# EasyEDA Pro project 光耦隔离继电器驱动模块.eprj

# Schematic 原理图
Create Date: 2022-03-02; Project Name: 光耦隔离继电器驱动模块; Schematic Name: Schematic1; Update Date: 2022-03-02
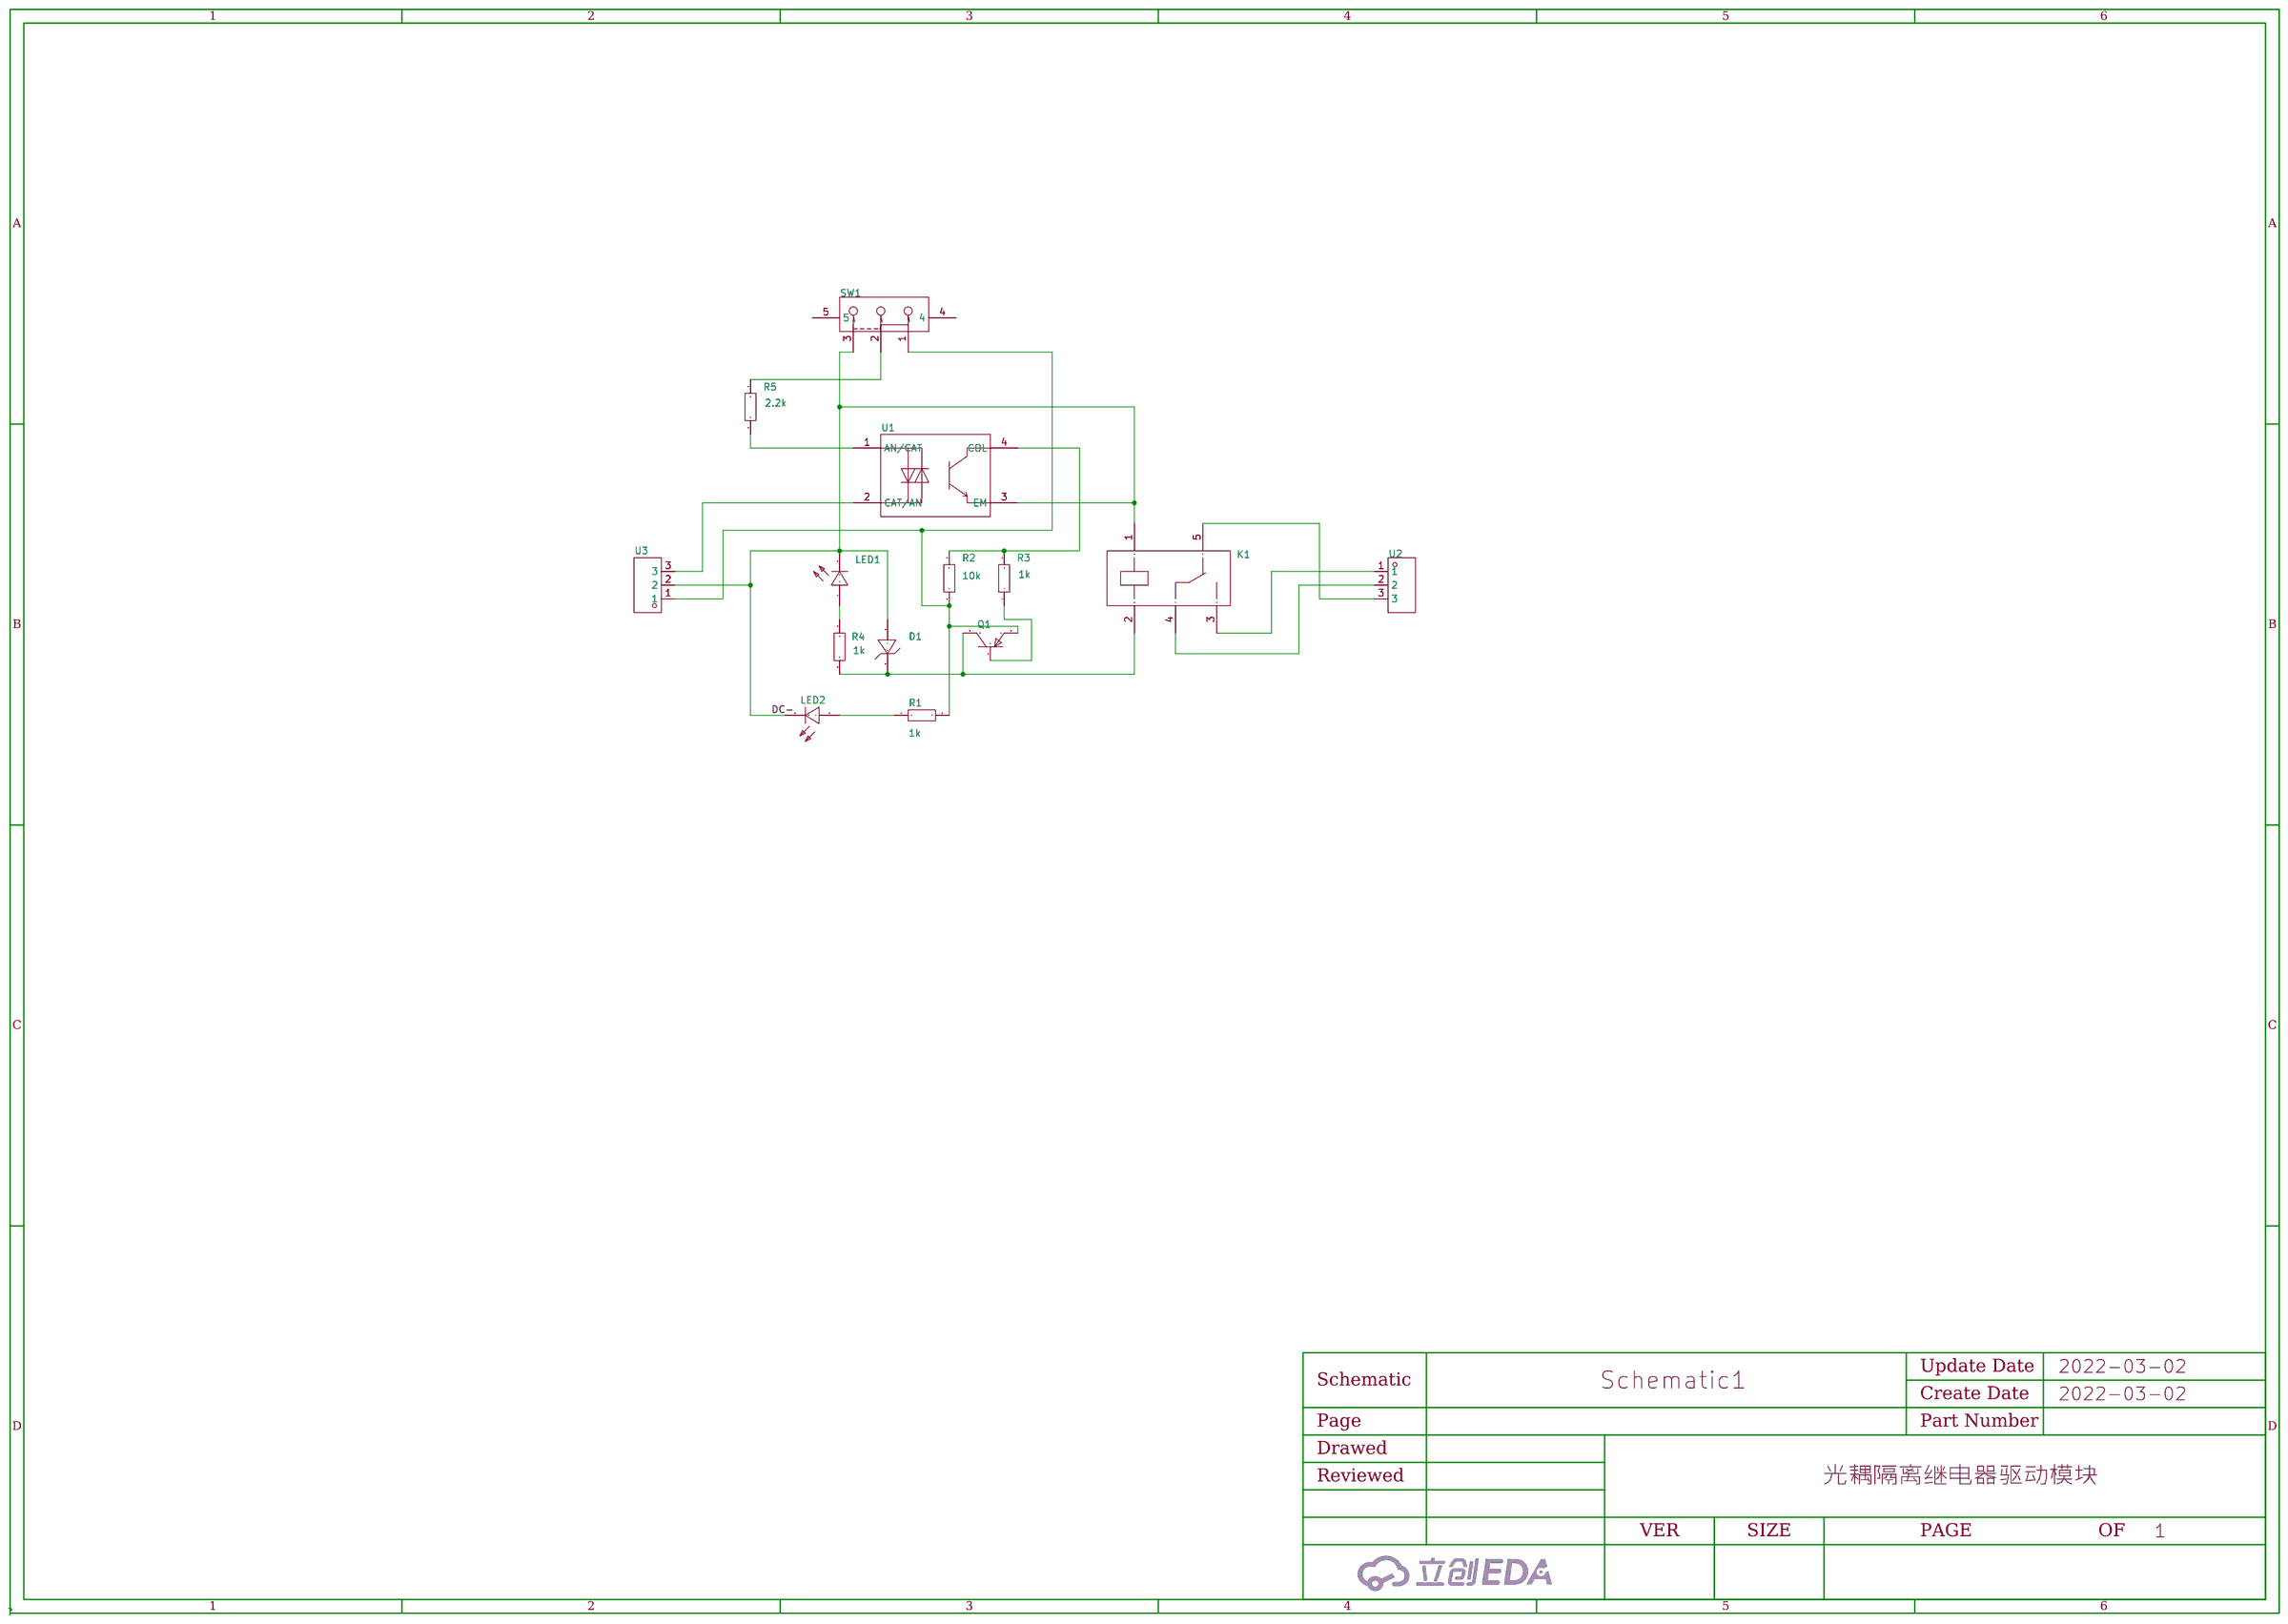
[diagram p0: schematic sheet]

## Parts
D1  -  [LL-34_L3.5-W1.5-RD]
K1  -  [RELAY-TH_HF3FF-XX-1ZXX-XXX]
LED1  -  [LED0603-R-RD]
LED2  -  [LED0603-R-RD]
Q1  -  [SOT-23-3_L2.9-W1.3-P1.90-LS2.4-BR]
R1  1k  [R0805]
R2  10k  [R0805]
R3  1k  [R0805]
R4  1k  [R0805]
R5  2.2k  [R0805]
SW1  -  [SW-TH_SK-12D02VG3]
U1  -  [SOP-4_L3.9-W4.4-P2.54-LS7.0-TL]
U2  -  [CONN-TH_3P-P5.00_KF301-5.0-3P]
U3  -  [CONN-TH_3P-P5.00_KF301-5.0-3P]

## Library data of the parts
D1 = GLZ5.1B_R1_10001: 二极管配置:独立式;稳压值(标称值):-;稳压值(范围):4.94V~5.2V;精度:-;功率:500mW;反向电流(Ir):5A@1.5V;阻抗(Zzt):20;; LCSC Part Name: 500mW; Supplier Part: C268545; Manufacturer: PANJIT(强茂); Supplier Footprint: LL34; JLCPCB Part Class: Extended Part; Datasheet: https://atta.szlcsc.com/upload/public/pdf/source/20190530/C268545_A16A4832D2A45A22F45E66DC8F34AE2C.pdf; Supplier: LCSC; Diode Configuration: 独立式; Zener Voltage (Range): 4.94V~5.2V; Power Dissipation: 500mW; Reverse Leakage Current (Ir): 5A@1.5V; Zener Impedance (Zzt): 20
K1 = JQC-3FF/005-1ZS(551): 继电器类型:General Purpose;线圈类型:Non Latching;线圈电压:5VDC;触点形式:SPDT;触点的额定电流:10A;; Supplier Part: C9221; Manufacturer: HF(宏发); Supplier Footprint: Through Hole; JLCPCB Part Class: Extended Part; Datasheet: https://atta.szlcsc.com/upload/public/pdf/source/20210906/31FD0911648F640D4227475E890A46EB.pdf; Supplier: LCSC; Relay Type: General Purpose; Coil Type: Non Latching; Coil Voltage: 5VDC; Contact Form: SPDT; Contact Rating (Current): 10A; Switching Voltage: (277VAC , 28VDC) Max
LED1 LED2 = 19-217/GHC-YR1S2/3T: 发光颜色:翠绿;二极管配置:-;透镜颜色:无色透明;主波长:520nm~535nm;峰值波长:518nm;色温:-;光通量(25时):-;测试电流:20mA;正向电压(VF):3.3V;发光强度:285mcd;功率:110mW;发光角度:120°;安装方式:-;工作温度:-40~+85;; LCSC Part Name: 翠绿LED; Supplier Part: C72043; Manufacturer: EVERLIGHT(台湾亿光); Supplier Footprint: 0603; JLCPCB Part Class: Basic Part; Datasheet: https://atta.szlcsc.com/upload/public/pdf/source/20160507/1462613613780.pdf; Supplier: LCSC; Emitted Color: 翠绿; Lens Color: 无色透明; Dominant Wavelength: 520nm~535nm; Peak Wavelength: 518nm; Forward Current: 20mA; Forward Voltage (VF): 3.3V; Luminous Intensity: 285mcd; Power Dissipation: 110mW; Viewing Angle: 120°; Operating Temperature: -40~+85
Q1 = S8550 2TY: 晶体管类型:PNP;集射极击穿电压(Vceo):25V;集电极电流(Ic):500mA;功率(Pd):300mW;; LCSC Part Name: S8550 2TY (200-350) (200-350); Supplier Part: C2147; Manufacturer: CJ（江苏长电/长晶）; Supplier Footprint: SOT-23(SOT-23-3); JLCPCB Part Class: Extended Part; Datasheet: https://atta.szlcsc.com/upload/public/pdf/source/20120512/1457706508743.pdf; Supplier: LCSC; Transistor Type: PNP; Collector-Emitter Breakdown Voltage (Vceo): 25V; Collector Current (Ic): 500mA; Power Dissipation (Pd): 300mW
R1-R5 = TR0603B10K0P0525Z: 电阻类型:薄膜电阻;阻值:10k;精度:±0.1%;功率:100mW;温度系数:±25ppm/;最大工作电压:75V;工作温度范围:-55~+155;; LCSC Part Name: 10k ±0.1% 100mW; Supplier Part: C188363; Manufacturer: EVER OHMS(天二科技); Supplier Footprint: 0603; JLCPCB Part Class: Extended Part; Datasheet: https://atta.szlcsc.com/upload/public/pdf/source/20190415/C188363_433BF05B6FB8F7A0F5F35A3E4390C55A.pdf; Supplier: LCSC; Type: 薄膜电阻; Tolerance: ±0.1%; Power(Watts): 100mW; Temperature Coefficient: ±25ppm/; Overload Voltage (Max): 75V; Operating Temperature Range: -55~+155
SW1 = SK-12D02VG3: 额定电流(DC):200mA;额定电压(DC):30V;额定电流(AC):-;额定电压(AC):-;电路结构:单刀双掷;安装方式:卧插;机械寿命:8000;滑钮形状:矩形柱状;引脚样式:PC引脚;工作温度:-10~+60;开关高度:-;; LCSC Part Name: 拨动开关/SK-12D02VG3  柄长 X=3mm; Supplier Part: C131374; Manufacturer: SOFNG(硕方); Supplier Footprint: 插件; JLCPCB Part Class: Extended Part; Datasheet: https://atta.szlcsc.com/upload/public/pdf/source/20200803/C131374_F571C33149E652932F6ED6FB204D34D9.pdf; Supplier: LCSC; Current Rating (DC): 200mA; Voltage Rating (DC): 30V; Circuit: 单刀双掷; Mounting Style: 卧插; Mechanical Life: 8000; Actuator Style: 矩形柱状; Pin Style: PC引脚; Operating Temperature: -10~+60
U1 = LTV-354T-A: 产品类型:晶体管输出;输入类型:AC, DC;通道数目:1;隔离电压:3750Vrms;; Supplier Part: C10802; Manufacturer: LITEON(台湾光宝); Supplier Footprint: SOP-4_2.54; JLCPCB Part Class: Extended Part; Datasheet: https://atta.szlcsc.com/upload/public/pdf/source/20130111/1457706575693.pdf; Supplier: LCSC; Product Type: 晶体管输出; Input Type: AC, DC; Number of Channels: 1; Voltage-Isolation: 3750Vrms; Output-Voltage(Max): 35V; Output-Current(Max): 50mA
U2 U3 = KF301-5.0-3P: 间距:5mm;排数:1;每排PIN数:3;安装方式:直针;额定电流:17A;额定电压:250V;线规 - AWG:14~22;线规 - mm?:1.5;工作温度范围:-30~+120;颜色:蓝色;; LCSC Part Name: 5mm 排数:1 每排P数:3 直针 可拼接 铜 环保; Supplier Part: C474882; Manufacturer: KEFA(科发); Supplier Footprint: P=5mm; JLCPCB Part Class: Extended Part; Datasheet: https://atta.szlcsc.com/upload/public/pdf/source/20200115/C474882_067BD45A25E5311BED9DE634CF3E69D8.pdf; Supplier: LCSC; Pitch: 5mm; Number of Rows: 1; Number of PINs Per Row: 3; Mounting Style: 直针; Current Rating (Max): 17A; Voltage Rating (Max): 250V; Wire Gauge - AWG: 14~22; Wire Gauge - mm?: 1.5; Operating Temperature Range: -30~+120; Color: 蓝色

## Nets
DC+: Q1.2(E) R1.2 R2.1 SW1.1 U3.1
DC-: D1.2(A) K1.1 LED1.2(C) LED2.2(C) SW1.3 U1.3(EM) U3.2
IN: U1.2(CAT/AN) U3.3
NET4: R5.2 SW1.2
$1N935: R2.2 R3.2 U1.4(COL)
$1N939: Q1.1(B) R3.1
$1N1359: R5.1 U1.1(AN/CAT)
$1N1760: D1.1(C) K1.2 Q1.3(C) R4.1
Net-(K1-3): K1.3 U2.1
Net-(K1-4): K1.4 U2.2
Net-(K1-5): K1.5 U2.3
Net-(LED1-1): LED1.1(A) R4.2
Net-(LED2-1): LED2.1(A) R1.1

Not connected (* = marked no-connect by the designer): SW1 4 5

# Board PCB
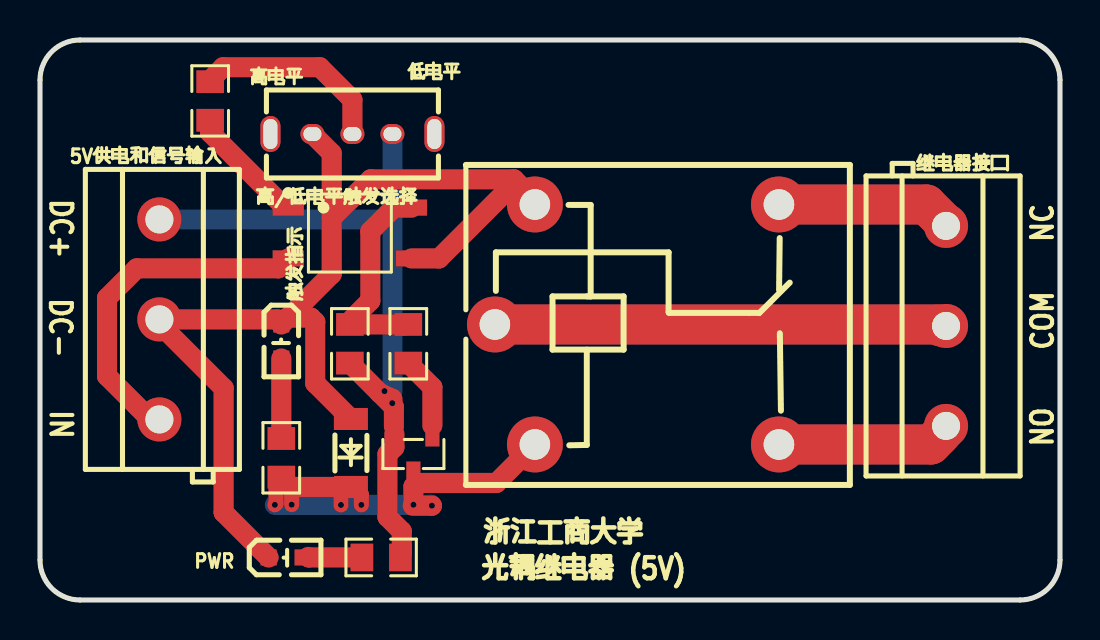
[diagram p1: board, top side]
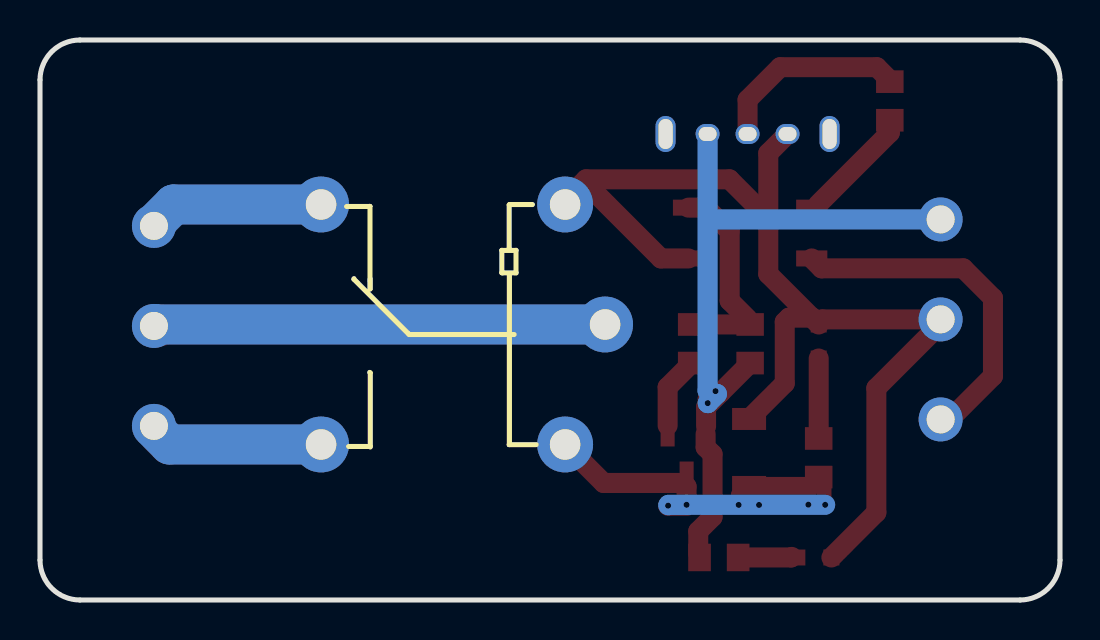
[diagram p2: board, bottom side, seen from below]

Outline 51 x 28 mm; copper layers: Top Layer, Bottom Layer. Coordinates in mm from the lower left corner of the outline.
Outline path: 0,26 0,2 arc(0.59,0.59) 2,0 49,0 arc(50.41,0.59) 51,2 51,26 arc(50.41,27.41) 49,28 2,28 arc(0.59,27.41) 0,26
Stack: Top Layer 0.035mm / 介电1 1.51mm FR4 er 4.5 / Bottom Layer 0.035mm

## Design rules (mm)
spacing safeClearance (default): track to track 0.152, other pairs 0.152 to 0.3
track width trackWidth (default): min 0.127, default 0.254, max 2.54
differential pair differentialPair (default): width min 0.127, default 0.254, max 2.54; gap min 0.152, default 0.152
via viaSize (default): diameter min 0.5, default 0.61, max 10; hole min 0.3, default 0.305, max 6

## Placement (name value [footprint] x y rotation side)
5V供电和信号输入  -  [CONN-TH_3P-P5.00_KF301-5.0-3P]  5.97 14.03 270 top
D1  -  [LL-34_L3.5-W1.5-RD]  15.55 7.35 90 top
K1  -  [RELAY-TH_HF3FF-XX-1ZXX-XXX]  29.84 13.78 0 top
PWR  -  [LED0603-R-RD]  12.28 2.13 0 top
Q1  -  [SOT-23-3_L2.9-W1.3-P1.90-LS2.4-BR]  18.67 7.3 90 top
R1  1k  [R0805]  17.06 2.13 0 top
R2  10k  [R0805]  15.49 12.81 90 top
R3  1k  [R0805]  18.41 12.81 90 top
R4  1k  [R0805]  12.06 7.11 90 top
R5  2.2k  [R0805]  8.51 24.95 90 top
U1  -  [SOP-4_L3.9-W4.4-P2.54-LS7.0-TL]  15.49 18.35 0 top
继电器接口  -  [CONN-TH_3P-P5.00_KF301-5.0-3P]  45.3 13.7 90 top
触发指示  -  [LED0603-R-RD]  12.06 12.92 270 top
高/低电平触发选择  -  [SW-TH_SK-12D02VG3]  15.62 23.3 180 top

## Footprints (pads in the part's own frame, mm; a bottom-side part is the same pattern mirrored in y, then rotated)
CONN-TH_3P-P5.00_KF301-5.0-3P
  round 2.2 hole 1.399: 1(-4.998,0) 2(0,0) 3(5.002,0)
LED0603-R-RD
  rect 0.8x0.8 smd: 1(0.851,0) 2(-0.851,0)
LL-34_L3.5-W1.5-RD
  rect 1.1x1.7 smd: 1(-1.7,0) 2(1.7,0)
R0805
  rect 1.133x1.377 smd: 1(-0.965,0) 2(0.965,0)
RELAY-TH_HF3FF-XX-1ZXX-XXX
  round 2.794 hole 1.524: 1(-5.101,6) 2(-5.101,-6) 3(7.102,-6) 4(-7.099,0) 5(7.102,6)
SOP-4_L3.9-W4.4-P2.54-LS7.0-TL
  rect 1.56x0.8 smd: 1(-3.081,1.27) 2(-3.081,-1.27) 3(3.081,-1.27) 4(3.081,1.27)
SOT-23-3_L2.9-W1.3-P1.90-LS2.4-BR
  rect 1.25x0.701 smd: 1(1.001,-0.95) 2(1.001,0.95) 3(-1.001,0)
SW-TH_SK-12D02VG3
  oval 1.199x1.001 hole 0.899x0.701: 1(-1.999,0) 2(0,0) 3(1.999,0)
  oval 1.001x1.801 hole 0.701x1.501: 4(4.099,0) 5(-4.099,0)

## Nets
DC+: 5V供电和信号输入.1 Q1.2 R1.2 R2.1 高/低电平触发选择.1
DC-: 5V供电和信号输入.2 D1.2 K1.1 PWR.2 U1.3 触发指示.2 高/低电平触发选择.3
IN: 5V供电和信号输入.3 U1.2
NET4: R5.2 高/低电平触发选择.2
$1N492: PWR.1 R1.1
$1N935: R2.2 R3.2 U1.4
$1N939: Q1.1 R3.1
$1N1058: R4.2 触发指示.1
$1N1359: R5.1 U1.1
$1N1760: D1.1 K1.2 Q1.3 R4.1
$1N3387: K1.4 继电器接口.2
$1N5124: K1.3 继电器接口.1
$1N5141: K1.5 继电器接口.3

Pads without a net: 高/低电平触发选择 4 5

## Via types
v1: diameter 0.61, hole 0.305, Top Layer to Bottom Layer, 8 vias

## Routing (per net, layer and track width the routed paths; a pad name or vN(x,y) marks a point on that pad's centre or on a via; arc(x,y) is an arc through that point)
DC+: length 37.1
  Top Layer w1.001: 16.99,10.35 17.7,9.64 17.7,8.69 ; 16.99,10.35 17.61,10.06 v1(17.61,9.84) ; 16.99,10.35 R2.1 ; 18.09,2.31 18.09,3.44 17.37,4.15 17.37,7.29 17.72,7.64 Q1.2
  Bottom Layer w0.254: 17.21,10.4 17.22,10.42 v1(17.22,10.44)
  Bottom Layer w1.001: 17.59,19.06 17.56,19.03 5V供电和信号输入.1 ; 17.61,9.84 17.61,9.85 17.16,10.3 17.62,10.47 高/低电平触发选择.1
DC-: length 56.2
  Top Layer w1.001: D1.2 13.76,10.83 13.76,13.9 13.55,14.12 12.41,14.12 ; 23.88,20.46 23.33,20.46 19.95,17.08 U1.3 ; 11.97,13.95 11.88,14.03 6.15,14.03 ; 6.15,14.03 5V供电和信号输入.2 ; 6.15,14.03 6.18,13.59 9.18,10.59 9.18,4.37 PWR.2 ; 14.59,19.09 14.59,16.3 12.41,14.12 ; 14.59,19.09 14.59,22.34 高/低电平触发选择.3 ; 14.59,19.09 16.53,21.03 23.7,21.03 24.7,20.03 ; 12.41,14.12 12.36,14.12 ; 12.41,14.12 触发指示.2
IN: length 16.8
  Top Layer w1.001: 5.47,9.08 3.35,11.2 3.35,15.1 4.84,16.58 11.92,16.58 U1.2
NET4: length 9.6
  Top Layer w1.001: 8.59,26.08 9.16,26.64 13.99,26.64 15.62,25.01 高/低电平触发选择.2
$1N492: length 2.7
  Top Layer w1.001: 13.41,2.15 13.44,2.13 R1.1
$1N935: length 10.1
  Top Layer w1.001: R2.2 18.21,13.78 18.24,13.74 ; U1.4 17.7,19.62 16.52,18.44 16.52,14.96 15.62,14.07
$1N939: length 3.6
  Top Layer w1.001: R3.1 19.62,10.64 19.62,8.72
$1N1058: length 3.8
  Top Layer w1.001: 触发指示.1 12.06,8.28 12.09,8.25
$1N1359: length 5.7
  Top Layer w1.001: 12.09,19.79 8.51,23.37 R5.1
$1N1760: length 22.7
  Top Layer w0.75: v1(15.05,4.75) 15.05,5.27 15.04,5.28 ; 11.8,5.67 11.8,4.82 v1(11.74,4.76) ; 16.06,5.28 16.07,5.28 v1(16.07,4.75) ; v1(12.58,4.77) 12.58,5.7 12.51,5.78
  Top Layer w1.001: 12.39,5.82 12.56,5.65 D1.1 ; 18.64,4.71 19.59,4.71 v1(19.59,4.72) ; K1.2 22.82,5.85 18.85,5.85 ; 18.68,5.68 18.67,5.67 v1(18.67,4.76)
  Bottom Layer w1.001: 19.59,4.74 19.57,4.76 v1(11.74,4.76)
$1N3387: length 44.8
  Top Layer w1.999: 45,13.68 44.91,13.78 K1.4
  Bottom Layer w1.999: K1.4 45.15,13.78 45.25,13.68
$1N5124: length 16.9
  Top Layer w1.999: 45.05,8.28 44.54,7.78 K1.3
  Bottom Layer w1.999: 45.24,8.5 44.52,7.78 K1.3
$1N5141: length 16.8
  Top Layer w1.999: 45.05,19.04 44.31,19.78 K1.5
  Bottom Layer w1.999: K1.5 44.31,19.78 45.03,19.05

## Text on the board
Top Silkscreen Layer: NO | NC | COM | DC- | DC+ | IN | 高电平 | 低电平 | 光耦继电器 (5V) | 浙江工商大学
